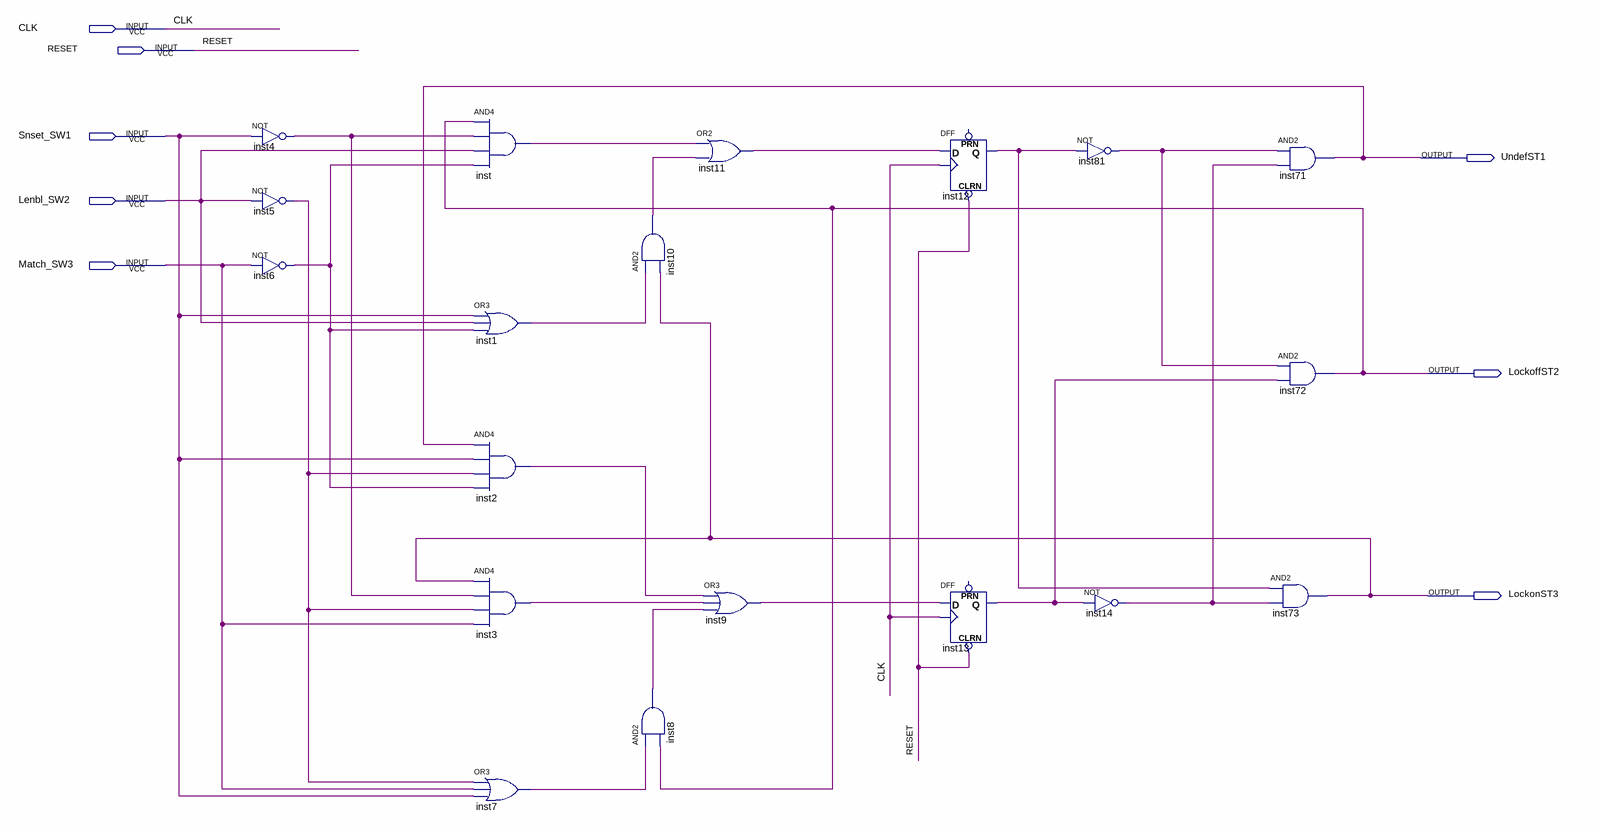
[diagram p0: schematic sheet]
// Quartus schematic stateMachine.bdf as structural Verilog: 19 symbols, 8 pins
module stateMachine (
  input  CLK,
  input  RESET,
  input  Snset_SW1,
  input  Lenbl_SW2,
  input  Match_SW3,
  output UndefST1,
  output LockoffST2,
  output LockonST3
);

  wire inst1_out, inst2_out, inst3_out, inst4_out, inst5_out, inst6_out, inst7_out, inst8_out, inst9_out,
       inst10_out, inst11_out, inst12_q, inst13_q, inst14_out, inst81_out, inst_out;

  not inst4 (inst4_out, Snset_SW1);
  not inst5 (inst5_out, Lenbl_SW2);
  not inst6 (inst6_out, Match_SW3);
  and inst (inst_out, LockoffST2, inst4_out, Lenbl_SW2, inst6_out);
  or inst1 (inst1_out, Snset_SW1, Lenbl_SW2, inst6_out);
  and inst2 (inst2_out, UndefST1, Snset_SW1, inst5_out, inst6_out);
  and inst3 (inst3_out, LockonST3, inst4_out, inst5_out, Match_SW3);
  or inst7 (inst7_out, inst5_out, Match_SW3, Snset_SW1);
  and inst10 (inst10_out, inst1_out, LockonST3);
  and inst8 (inst8_out, inst7_out, LockoffST2);
  or inst11 (inst11_out, inst_out, inst10_out);
  or inst9 (inst9_out, inst2_out, inst3_out, inst8_out);
  DFF inst12 (.CLRN(RESET), .CLK(CLK), .D(inst11_out), .Q(inst12_q));  // open: PRN
  DFF inst13 (.CLRN(RESET), .CLK(CLK), .D(inst9_out), .Q(inst13_q));  // open: PRN
  not inst81 (inst81_out, inst12_q);
  not inst14 (inst14_out, inst13_q);
  and inst71 (UndefST1, inst81_out, inst14_out);
  and inst72 (LockoffST2, inst81_out, inst13_q);
  and inst73 (LockonST3, inst12_q, inst14_out);
endmodule
